# Altium schematic sheet 9axe.SchDoc
size A4
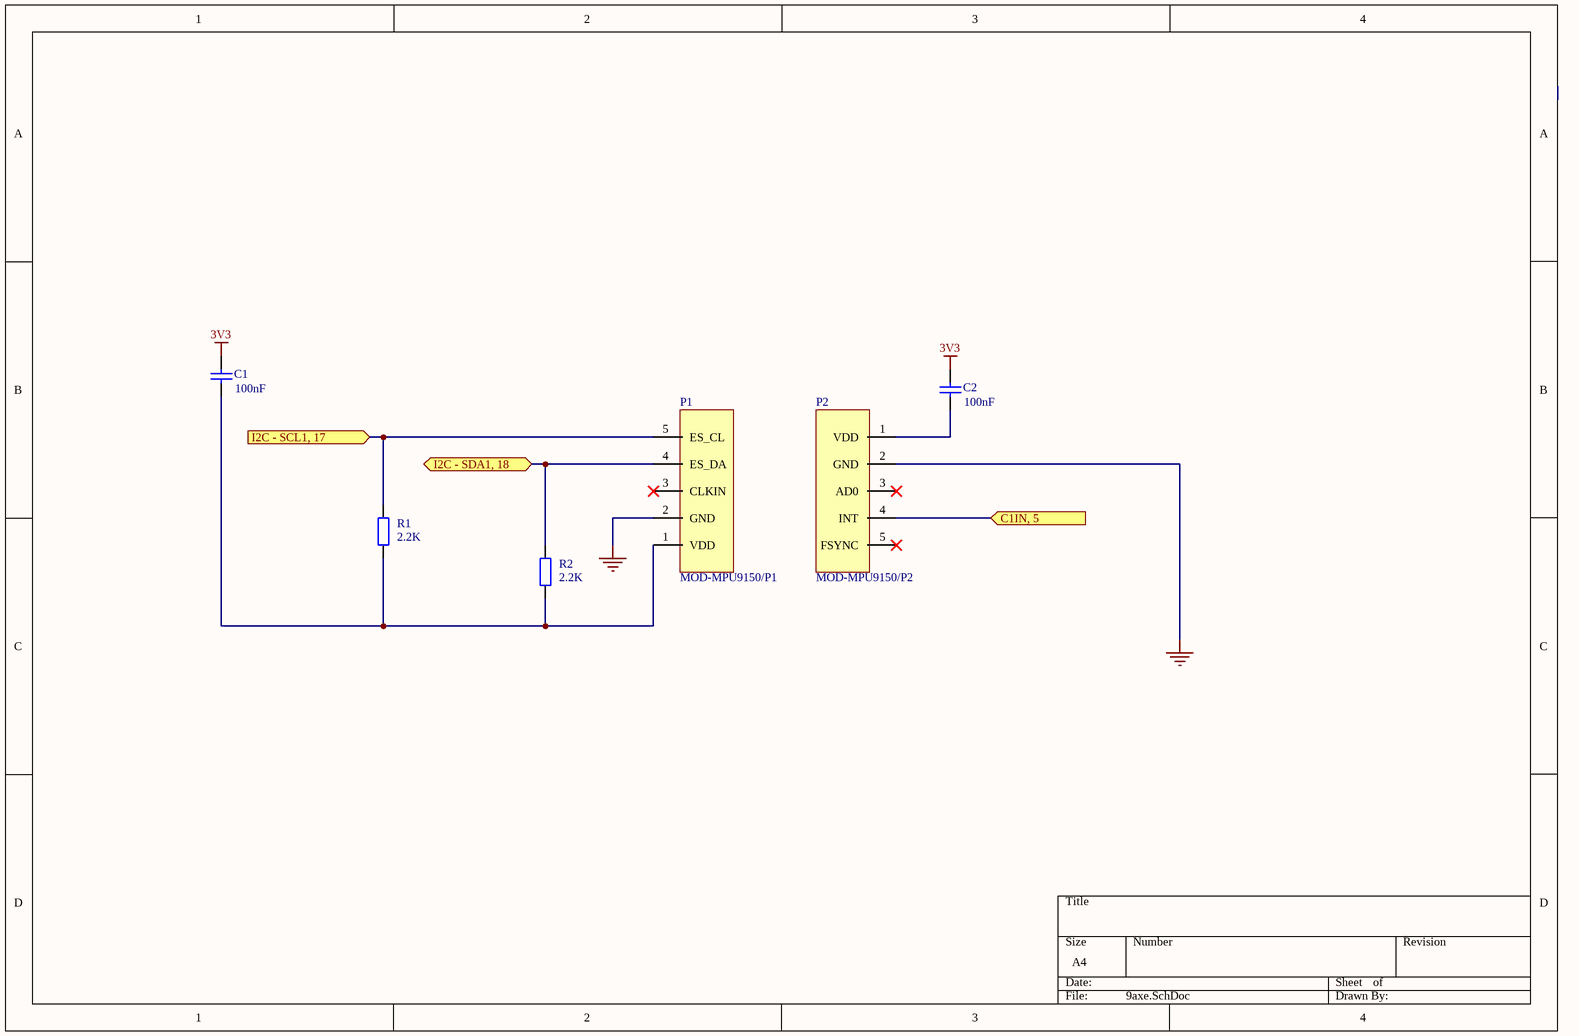
[diagram p0: 9axe.SchDoc]

## Parts
C1  value 100nF  [RAD-0.3]
C2  value 100nF  [RAD-0.3]
P1  MOD-MPU9150/P1
P2  MOD-MPU9150/P2
R1  2.2K  [AXIAL-0.4]
R2  2.2K  [AXIAL-0.4]

## Ports
C1IN, 5 (in), I2C - SCL1, 17 (in), I2C - SDA1, 18 (bidir)

## Nets
3V3: C1.2 C2.2
GND: P1.2(GND) P2.2(GND)
C1IN, 5: P2.4(INT) ; port C1IN, 5
I2C - SCL1, 17: P1.5(ES_CL) R1.2 ; port I2C - SCL1, 17
I2C - SDA1, 18: P1.4(ES_DA) R2.1 ; port I2C - SDA1, 18
NetC1_1: C1.1 P1.1(VDD) R1.1 R2.2
NetC2_1: C2.1 P2.1(VDD)

Not connected (* = marked no-connect by the designer): P1 3(CLKIN)*; P2 3(AD0)* 5(FSYNC)*

## Library data of the parts
C1 C2 = Cap: Capacitor; Published: 8-Jun-2000; LatestRevisionDate: 17-Jul-2002; LatestRevisionNote: Re-released for DXP Platform.; PackageReference: RAD-0.3; Publisher: Altium Limited; PackageDescription: Radial Cap, Thru-Hole; 2 Leads; 0.3 in Pin Spacing
R1 R2 = Res2: Resistor; Value: 3.3K; Fabricant: MULTICOMP; RefFabricant: MF12 3K3; RefFournisseur: 9343040; Fournisseur: Farnell; Published: 8-Jun-2000; LatestRevisionDate: 17-Jul-2002; LatestRevisionNote: Re-released for DXP Platform.; PackageReference: AXIAL-0.4; Publisher: Altium Limited; PackageDescription: Axial Device, Thru-Hole; 2 Leads; 0.4 in Pin Spacing